# Altium schematic sheet 02 - POWER.SchDoc
size 420 x 297 mm
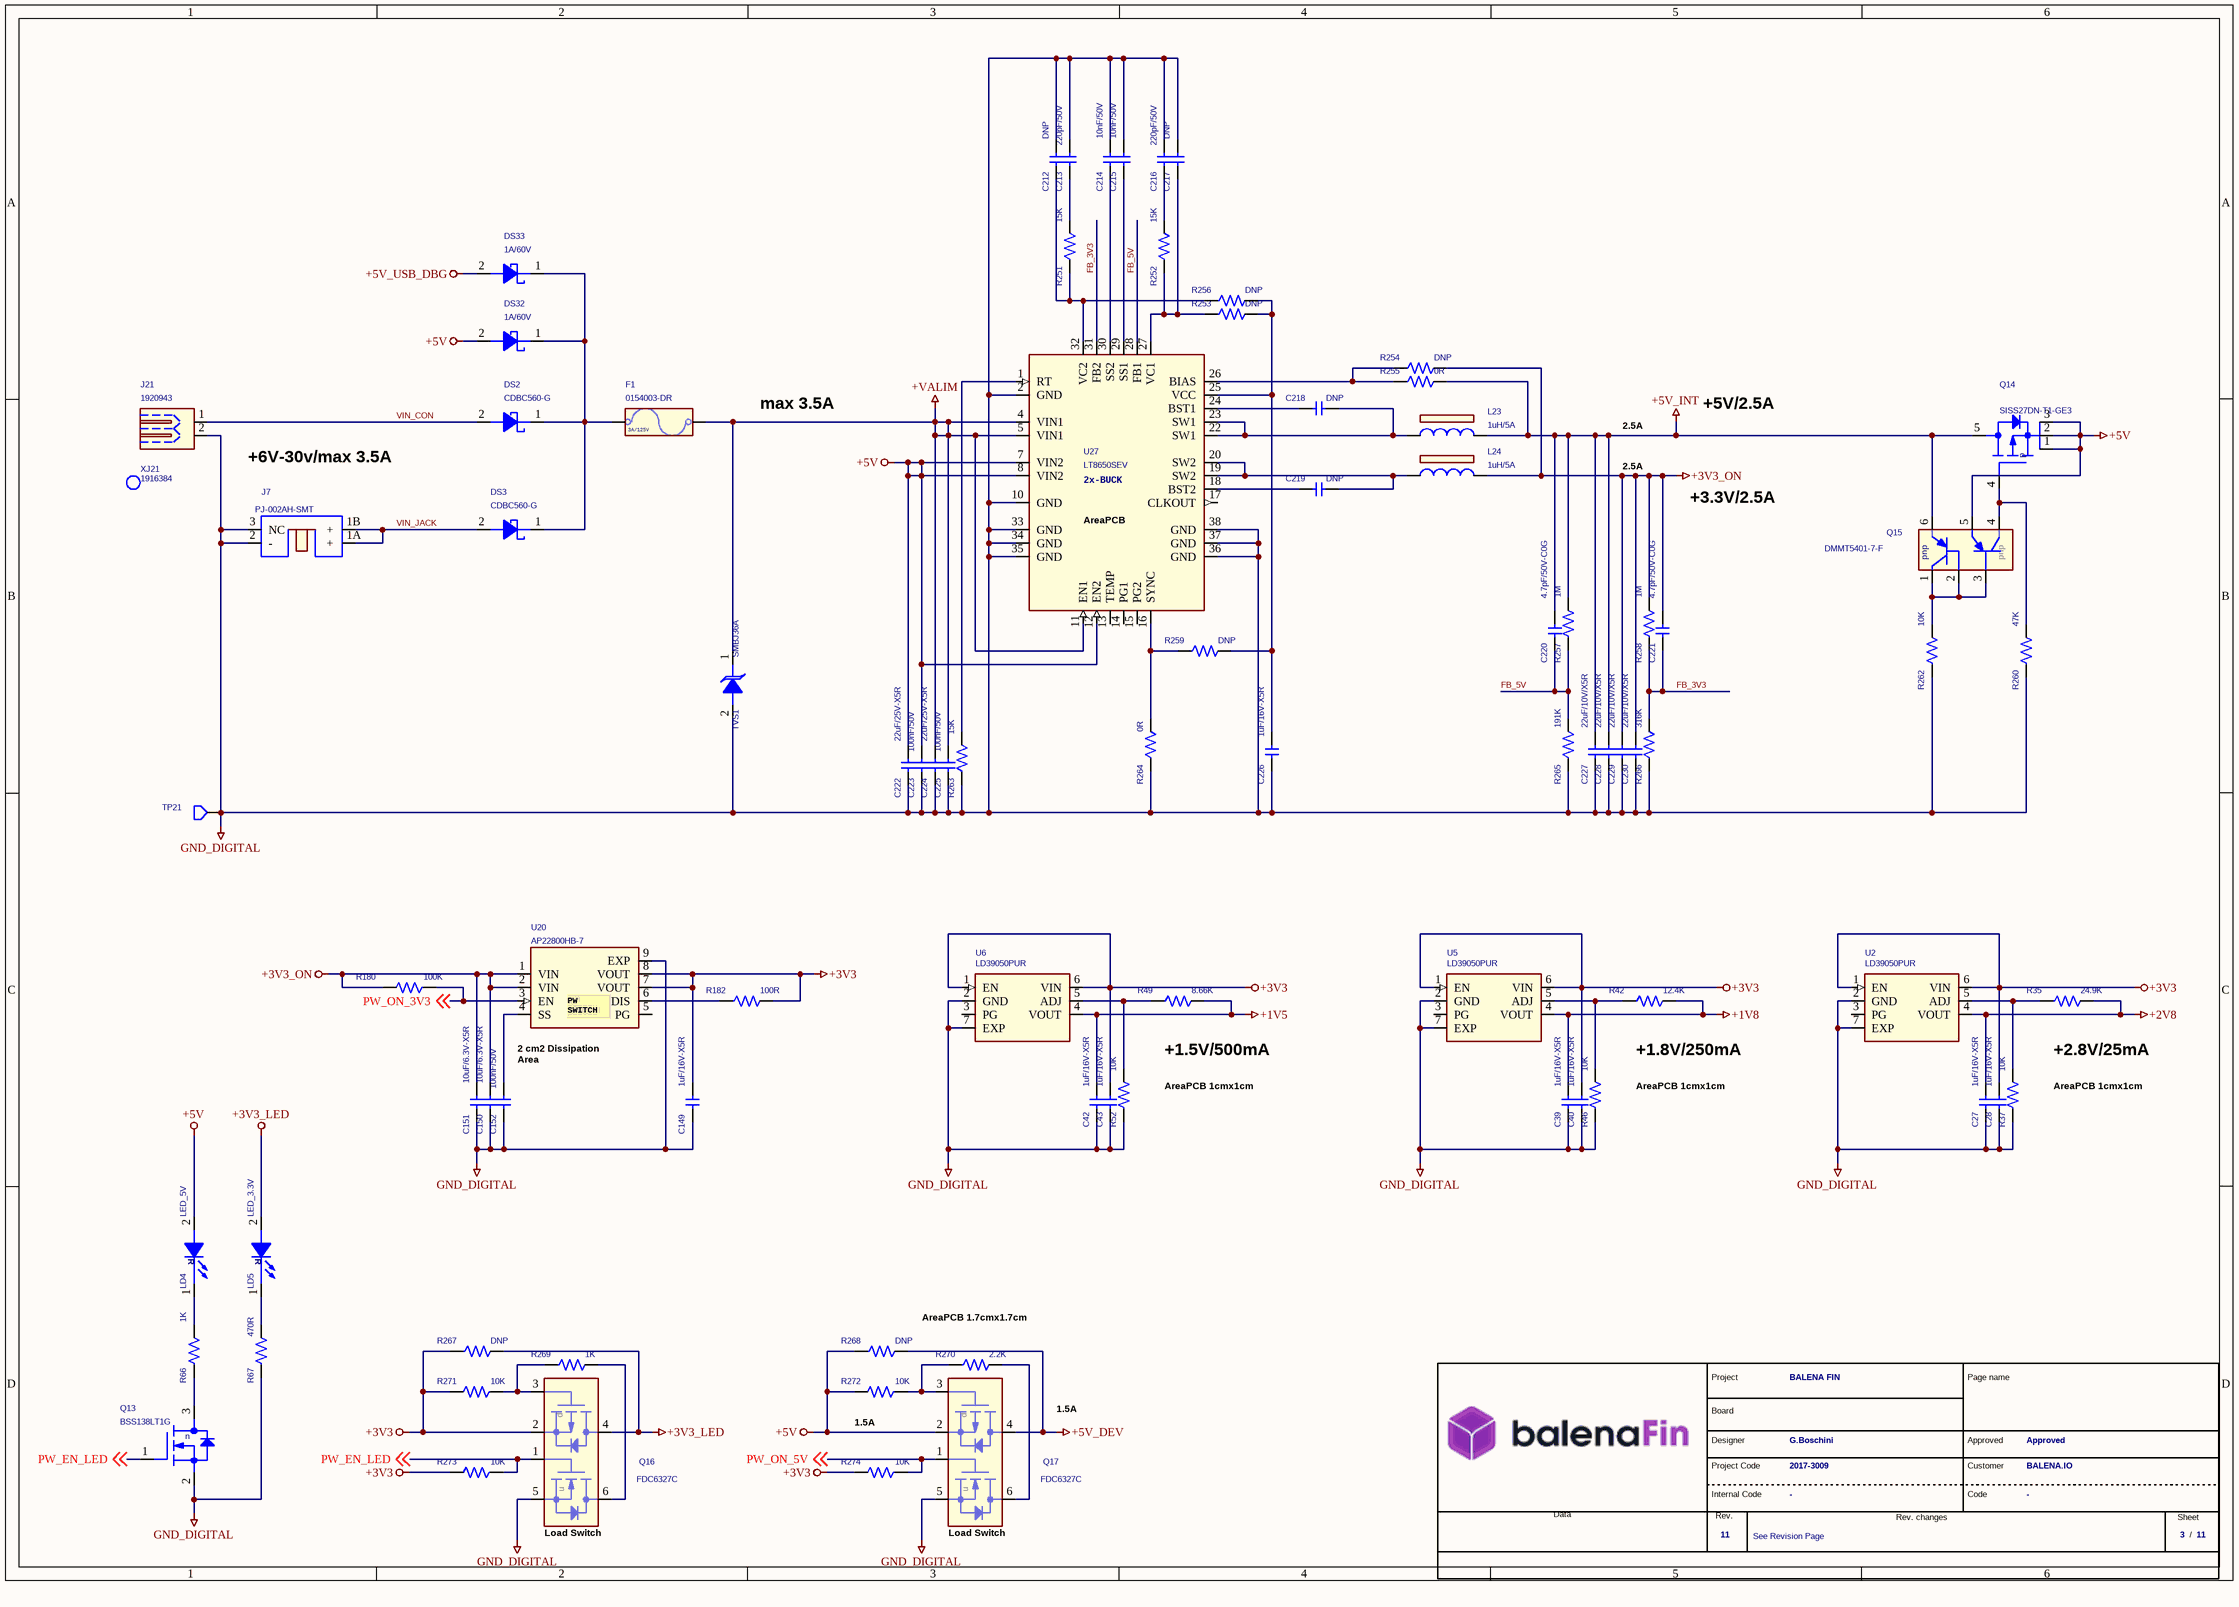
[diagram p0: 02 - POWER.SchDoc]

## Parts
*  Revision: 11  FAE RD code: 2017-3009  DocumentoRev: See Revision Page  Page Number: 3  Nome Progetto: BALENA FIN  Customer name: BALENA.IO  Project manager: Approved  Project designer: G.Boschini  (hidden comment: MyFAEVuoto)  (graphical)
C27  1uF/16V-X5R  [CS-C-0402]
C28  1uF/16V-X5R  [CS-C-0402]
C39  1uF/16V-X5R  [CS-C-0402]
C40  1uF/16V-X5R  [CS-C-0402]
C42  1uF/16V-X5R  [CS-C-0402]
C43  1uF/16V-X5R  [CS-C-0402]
C149  1uF/16V-X5R  [CS-C-0402]
C150  10uF/6.3V-X5R  [CS-C-0402]
C151  10uF/6.3V-X5R  [CS-C-0402]
C152  100nF/50V  [CS-C-0402]
C212  DNP  [CS-C-0402]
C213  220pF/50V  [CS-C-0402]
C214  10nF/50V  [CS-C-0402]
C215  10nF/50V  [CS-C-0402]
C216  220pF/50V  [CS-C-0402]
C217  DNP  [CS-C-0402]
C218  DNP  [CS-C-0402]
C219  DNP  [CS-C-0402]
C220  4.7pF/50V-C0G  [CS-C-0402]
C221  4.7pF/50V-C0G  [CS-C-0402]
C222  22uF/25V-X5R  [CS-C-1206]
C223  100nF/50V  [CS-C-0603]
C224  22uF/25V-X5R  [CS-C-1206]
C225  100nF/50V  [CS-C-0603]
C226  1uF/16V-X5R  [CS-C-0402]
C227  22uF/10V/X5R  [CS-C-0603]
C228  22uF/10V/X5R  [CS-C-0603]
C229  22uF/10V/X5R  [CS-C-0603]
C230  22uF/10V/X5R  [CS-C-0603]
DS2  CDBC560-G  [SMC]
DS3  CDBC560-G  [SMC]
DS32  1A/60V  [SMA]
DS33  1A/60V  [SMA]
F1  0154003-DR  [F-LT154]
J7  PJ-002AH-SMT  [J-CUPJ002AH]
J21  1920943  [J-2-0350-MOT-MC]
L23  1uH/5A  [LS-VIIHLP1212BZ11]
L24  1uH/5A  [LS-VIIHLP1212BZ11]
LD4  LED_5V  [LD-0603]
LD5  LED_3.3V  [LD-0603]
Q13  BSS138LT1G  [SOT23]
Q14  SISS27DN-T1-GE3  [POWERVDFN8-0330X0330]
Q15  DMMT5401-7-F  [SOT23-6L]
Q16  FDC6327C  [SOT23-6-DBV]
Q17  FDC6327C  [SOT23-6-DBV]
R35  24.9K  [RS-0402]
R37  10K  [RS-0402]
R42  12.4K  [RS-0402]
R46  10K  [RS-0402]
R49  8.66K  [RS-0402]
R52  10K  [RS-0402]
R66  1K  [RS-0402]
R67  470R  [RS-0402]
R180  100K  [RS-0402]
R182  100R  [RS-1206]
R251  15K  [RS-0402]
R252  15K  [RS-0402]
R253  DNP  [RS-0402]
R254  DNP  [RS-0402]
R255  0R  [RS-0402]
R256  DNP  [RS-0402]
R257  1M  [RS-0402]
R258  1M  [RS-0402]
R259  DNP  [RS-0402]
R260  47K  [RS-0402]
R262  10K  [RS-0402]
R263  15K  [RS-0402]
R264  0R  [RS-0402]
R265  191K  [RS-0402]
R266  316K  [RS-0402]
R267  DNP  [RS-0603]
R268  DNP  [RS-0603]
R269  1K  [RS-0402]
R270  2.2K  [RS-0402]
R271  10K  [RS-0402]
R272  10K  [RS-0402]
R273  10K  [RS-0402]
R274  10K  [RS-0402]
TP21  TPT  [TPT-0100]  (value not drawn)
TVS1  SMBJ36A  [SMB]
U2  LD39050PUR  [DFN6_3X3_STM-L]
U5  LD39050PUR  [DFN6_3X3_STM-L]
U6  LD39050PUR  [DFN6_3X3_STM-L]
U20  AP22800HB-7  [UFDFN8-EXP-0210X0160]
U27  LT8650SEV  [IC-LT8650SEV]
XJ21  1916384  (mechanical)

## Nets
+1V5: C42.1 R49.2 U6.4(VOUT)
+1V8: C39.1 R42.2 U5.4(VOUT)
+2V8: C27.1 R35.2 U2.4(VOUT)
+3V3: C28.1 C40.1 C43.1 C149.1 Q16.2(S1) R182.2 R267.1 R271.2 R273.2 R274.2 U2.1(EN) U2.6(VIN) U5.1(EN) U5.6(VIN) U6.1(EN) U6.6(VIN) U20.7(VOUT) U20.8(VOUT)
+3V3_LED: LD5.2(A) Q16.4(D1) R267.2
+3V3_ON: C150.1 C151.1 C221.1 C229.1 C230.1 L24.2 R180.2 R254.2 R258.2 U20.1(VIN) U20.2(VIN)
+5V: C222.1 C223.1 DS32.2(A) LD4.2(A) Q14.1(S_1) Q14.2(S_2) Q14.3(S_3) Q15.5(E2) Q17.2(S1) R268.1 R272.2 U27.7(VIN2) U27.8(VIN2) U27.12(EN2)
+5V_DEV: Q17.4(D1) R268.2
+5V_INT: C220.1 C227.1 C228.1 L23.2 Q14.5(D_5) Q15.6(E1) R255.2 R257.2
+5V_USB_DBG: DS33.2(A)
+VALIM: C224.1 C225.1 F1.2 TVS1.1(C) U27.4(VIN1) U27.5(VIN1) U27.11(EN1)
GND_DIGITAL: C27.2 C28.2 C39.2 C40.2 C42.2 C43.2 C149.2 C150.2 C151.2 C152.2 C212.1 C213.1 C214.1 C215.1 C216.1 C217.1 C222.2 C223.2 C224.2 C225.2 C226.2 C227.2 C228.2 C229.2 C230.2 J7.2(-) J7.3(NC) J21.2 Q13.2(S) Q16.5(S2) Q17.5(S2) R37.1 R46.1 R52.1 R67.1 R260.1 R262.1 R263.1 R264.1 R265.1 R266.1 TP21.1(TP) TVS1.2(A) U2.2(GND) U2.7(EXP) U5.2(GND) U5.7(EXP) U6.2(GND) U6.7(EXP) U20.9(EXP) U27.2(GND) U27.10(GND) U27.33(GND) U27.34(GND) U27.35(GND) U27.36(GND) U27.37(GND) U27.38(GND)
FB_3V3: C221.2 R258.1 R266.2 U27.31(FB2)
FB_5V: C220.2 R257.1 R265.2 U27.28(FB1)
PW_EN_LED: Q13.1(G) Q16.1(G2) R273.1 ; off-sheet PW_EN_LED
PW_ON_3V3: R180.1 U20.3(EN) ; off-sheet PW_ON_3V3
PW_ON_5V: Q17.1(G2) R274.1 ; off-sheet PW_ON_5V
VIN_CON: DS2.2(A) J21.1
VIN_JACK: DS3.2(A) J7.1A(+) J7.1B(+)
NetC152_1: C152.1 U20.4(SS)
NetC212_2: C212.2 R251.1 R256.1 U27.32(VC2)
NetC213_2: C213.2 R251.2
NetC214_2: C214.2 U27.30(SS2)
NetC215_2: C215.2 U27.29(SS1)
NetC216_2: C216.2 R252.2
NetC217_2: C217.2 R252.1 R253.1 U27.27(VC1)
NetC218_1: C218.1 U27.24(BST1)
NetC218_2: C218.2 L23.1 U27.22(SW1) U27.23(SW1)
NetC219_1: C219.1 U27.18(BST2)
NetC219_2: C219.2 L24.1 U27.19(SW2) U27.20(SW2)
NetC226_1: C226.1 R253.2 R256.2 R259.2 U27.25(VCC)
NetDS2_1: DS2.1(C) DS3.1(C) DS32.1(C) DS33.1(C) F1.1
NetLD4_1: LD4.1(C) R66.2
NetLD5_1: LD5.1(C) R67.2
NetQ13_3: Q13.3(D) R66.1
NetQ14_4: Q14.4(G) Q15.4(C2) R260.2
NetQ15_1: Q15.1(C1) Q15.2(B1) Q15.3(B2) R262.2
NetQ16_3: Q16.3(G1) R269.1 R271.1
NetQ16_6: Q16.6(D2) R269.2
NetQ17_3: Q17.3(G1) R270.1 R272.1
NetQ17_6: Q17.6(D2) R270.2
NetR35_1: R35.1 R37.2 U2.5(ADJ)
NetR42_1: R42.1 R46.2 U5.5(ADJ)
NetR49_1: R49.1 R52.2 U6.5(ADJ)
NetR182_1: R182.1 U20.6(DIS)
NetR254_1: R254.1 R255.1 U27.26(BIAS)
NetR259_1: R259.1 R264.2 U27.16(SYNC)
NetR263_2: R263.2 U27.1(RT)

Not connected (* = marked no-connect by the designer): U2 3(PG); U5 3(PG); U6 3(PG); U20 5(PG); U27 13(TEMP) 14(PG1) 15(PG2) 17(CLKOUT)

## Notes on the sheet
- +6V-30v/max 3.5A
- max 3.5A
- 2.5A
- +5V/2.5A
- (near U27) AreaPCB
- +3.3V/2.5A
- 2 cm2 Dissipation
  Area
- +1.5V/500mA
- +1.8V/250mA
- +2.8V/25mA
- AreaPCB 1cmx1cm
- AreaPCB 1.7cmx1.7cm
- 1.5A
- (near Q16) Load Switch
- (near Q17) Load Switch
- (in symbol BUCK-2X-LT8650SEV- 4A/ADJ) 2x-BUCK
- (in symbol LED R - GENERICO - 0603) R
- (in symbol MyFAEVuoto) Project; Page name; Board; Designer; Project Code; Customer; Internal Code; Code; Data; Rev.; Rev. changes; Sheet; /
- (in symbol N-P MOS-FDC6327C-2.7A/1.9A/20V) p; n
- (in symbol NMOS - BSS138 - 0.2A/50V) n
- (in symbol PMOS - SISS27DN - 23A/30V) p
- (in symbol PNPPNP - DMMT5401-7-F-0.2A/150V) pnp
- (in symbol PSW - 1x - AP22800HB-7) PW / SWITCH
- (in symbol RAPIDO - 0154003.DR - 3A/125V) 3A/125V

## Library data of the parts
C27 C28 = CS-C-0402-1u/16-X5R: CHIP CAP.CER. 1uF 16V 10% X5R 0402; MPN: Generic; Pkg Type: SMD; Room: POWER 2V8; Mount: Yes
C39 C40 = CS-C-0402-1u/16-X5R: CHIP CAP.CER. 1uF 16V 10% X5R 0402; MPN: Generic; Pkg Type: SMD; Room: POWER 1V8; Mount: Yes
C42 C43 = CS-C-0402-1u/16-X5R: CHIP CAP.CER. 1uF 16V 10% X5R 0402; MPN: Generic; Pkg Type: SMD; Room: POWER 1V5; Mount: Yes
C149 = CS-C-0402-1u/16-X5R: CHIP CAP.CER. 1uF 16V 10% X5R 0402; MPN: Generic; Pkg Type: SMD; Room: SWITCH-PW-3V3; Mount: Yes
C150 C151 = CS-C-0402-10u/6V3-X5R: CHIP CAP.CER. 10uF 6.3V 20% X5R 0402; MPN: Generic; Alternative MPN: CC0402MRX5R5BB106; Pkg Type: SMD; Room: SWITCH-PW-3V3; Temperature range: -55°..+85°; Mount: Yes
C152 = CS-C-0402-100n/16V: CHIP CAP.CER. 100nF 16V 10% X7R 0402; MPN: Generic; Alternative MPN: C0402C104K4RACTU; Room: SWITCH-PW-3V3; Pkg Type: SMD; Mount: Yes
C212 C217 = CS-C-0402: CHIP CAP.CER. 0402; MPN: Generic; Room: POWER 5V-3V3; Pkg Type: SMD; Mount: No
C213 C216 = CS-C-0402-220p/50V: CHIP CAP.CER. 220pF 50V 10% X7R 0402; MPN: Generic; Room: POWER 5V-3V3; Pkg Type: SMD; Mount: Yes
C214 C215 = CS-C-0402-10n/50V: CHIP CAP.CER. 10nF 50V 10% X7R 0402; MPN: Generic; Alternative MPN: C0402C103K5RACTU; Room: POWER 5V-3V3; Pkg Type: SMD; Mount: Yes
C218 C219 = CS-C-0402: CHIP CAP.CER. 0402; MPN: Generic; Pkg Type: SMD; Mount: No
C220 C221 = CS-C-0402-4.7p/50V-C0G: CHIP CAP.CER. 4.7pF 50V 5% C0G 0402; MPN: Generic; Pkg Type: SMD; Room: POWER 5V-3V3; Temperature range: -55°..+125°; Mount: Yes
C222 C224 = CS-C-1206-22u/25V-X5R: CHIP CAP.CER. 22uF 25V 10% X5R 1206; MPN: Generic; Room: POWER 5V-3V3; Pkg Type: SMD; Temperature range: -55°..+85°; Mount: Yes
C223 C225 = CS-C-0603-100n/50V: CHIP CAP.CER. 100nF 50V 10% X7R 0603; MPN: Generic; Alternative MPN: C0402C104K4RACTU; Room: POWER 5V-3V3; Pkg Type: SMD; Mount: Yes
C226 = CS-C-0402-1u/16-X5R: CHIP CAP.CER. 1uF 16V 10% X5R 0402; MPN: Generic; Pkg Type: SMD; Room: POWER 5V-3V3; Mount: Yes
C227-C230 = CS-C-0603-22u/10V/X5R: CHIP CAP.CER. 22uF 10V 20% X5R 0603; MPN: Generic; Pkg Type: SMD; Room: POWER 5V-3V3; Temperature range: -55°..+85°; Mount: Yes
DS2 DS3 = SCHOTTKY-CDBC560-G - 5A/60V: DIODE SCHOTTKY 5A 60V CDBC560-G DO214AB SMT; Pkg Type: SMD; Room: POWER IN; MPN: CDBC560-G; Mount: Yes
DS32 DS33 = SCHOTTKY-MBRA160 - 1A/60V: DIODE SCHOTTKY 1A 60V MBRA160T3G SMA SMT; Pkg Type: SMD; Room: POWER IN; MPN: MBRA160T3G; Mount: Yes
F1 = RAPIDO - 0154003.DR - 3A/125V: FUSE BOARD MNT 3A 125VAC/VDC SMD; Room: POWER IN; Pkg Type: SMD; MPN: 0154003-DR; Mount: Yes
J7 = JACK-PW - J-CUPJ002AH: CONN. POWER JACK F/90° PJ-002AH-SMT-TR CUI SMT; Alternative MPN: 694106106102; Pkg Type: SMD; Note: ID=2.1mm OD=5.5mm; Room: POWER IN; MPN: PJ-002AH-SMT; Mount: Yes
J21 = MC - J-2-0350-MOT-MC: TERM BLOCK HDR 2POS 90DEG 3.5MM; Pkg Type: THT; Room: POWER IN; MPN: 1920943; Mount: Yes
L23 L24 = PW-IHLP1212BZER1R0M11-1u/5A: FIXED IND 1UH 5A 24 MOHM SMD; Room: POWER 5V-3V3; Pkg Type: SMD; Temperature range: -55°..+125°; MPN: IHLP1212BZER1R0M11; Mount: Yes
LD4 LD5 = LED R - GENERICO - 0603: LED Red 0603 SMT; Alternative MPN: LTST-C191KRKT; Pkg Type: SMD; Note: 2V/20mA; Room: POWER LED; MPN: Generic; Mount: Yes
Q13 = NMOS - BSS138 - 0.2A/50V: MOSFET N-CH 50V 220MA SOT23-3; Room: HDMI; Pkg Type: SMD; MPN: BSS138LT1G; Mount: Yes
Q14 = PMOS - SISS27DN - 23A/30V: MOSFET P-CH 30V 50A PPAK 1212-8S; Pkg Type: SMD; Room: POWER 5V-3V3; Temperature range: -65°..+150°; MPN: SISS27DN-T1-GE3; Mount: Yes
Q15 = PNPPNP - DMMT5401-7-F-0.2A/150V: TRANS 2PNP 150V 0.2A SOT26; Room: POWER 5V-3V3; Pkg Type: SMD; Temperature range: -55°..+150°; MPN: DMMT5401-7-F; Mount: Yes
Q16 = N-P MOS-FDC6327C-2.7A/1.9A/20V: MOSFET N/P-CH 20V SSOT-6; Room: SWITCH-PW-LED; Pkg Type: SMD; Temperature range: -55°..+150°; MPN: FDC6327C; Mount: Yes
Q17 = N-P MOS-FDC6327C-2.7A/1.9A/20V: MOSFET N/P-CH 20V SSOT-6; Room: SWITCH-PW-5V; Pkg Type: SMD; Temperature range: -55°..+150°; MPN: FDC6327C; Mount: Yes
R35 = RS-0402-24.9k: CHIP RES. 24K9 0402 1/16W 1%; MPN: Generic; Room: POWER 2V8; Pkg Type: SMD; Mount: Yes
R37 = RS-0402-10k: CHIP RES. 10K 0402 1/16W 1%; MPN: Generic; Room: POWER 2V8; Pkg Type: SMD; Temperature range: -55°..+125°; Mount: Yes
R42 = RS-0402-12.4k: CHIP RES. 12K4 0402 1/16W 1% 100PPM/°C; MPN: Generic; Room: POWER 1V8; Note: 100ppm; Pkg Type: SMD; Mount: Yes
R46 = RS-0402-10k: CHIP RES. 10K 0402 1/16W 1%; MPN: Generic; Room: POWER 1V8; Pkg Type: SMD; Temperature range: -55°..+125°; Mount: Yes
R49 = RS-0402-8.66k: CHIP RES. 8K66 0402 1/16W 1% 100PPM/°C; MPN: Generic; Room: POWER 1V5; Note: 100ppm; Pkg Type: SMD; Temperature range: -55°..+155°; Mount: Yes
R52 = RS-0402-10k: CHIP RES. 10K 0402 1/16W 1%; MPN: Generic; Room: POWER 1V5; Pkg Type: SMD; Temperature range: -55°..+125°; Mount: Yes
R66 = RS-0402-1k: CHIP RES. 1K 0402 1/16W 1%; MPN: Generic; Pkg Type: SMD; Room: POWER LED; Mount: Yes
R67 = RS-0402-470r: CHIP RES. 470R 0402 1/16W 1%; MPN: Generic; Pkg Type: SMD; Room: POWER LED; Mount: Yes
R180 = RS-0402-100k: CHIP RES. 100K 0402 1/16W 1%; MPN: Generic; Pkg Type: SMD; Room: SWITCH-PW-3V3; Mount: Yes
R182 = RS-1206-100r: CHIP RES. 100R 1206 1/4W 1%; MPN: Generic; Pkg Type: SMD; Room: SWITCH-PW-3V3; Mount: Yes
R251 R252 R263 = RS-0402-15k: CHIP RES. 15K 0402 1/16W 1%; MPN: Generic; Pkg Type: SMD; Room: POWER 5V-3V3; Temperature range: -55°..+155°; Mount: Yes
R253 R254 R256 R259 = RS-0402: CHIP RES. 0402; MPN: Generic; Pkg Type: SMD; Room: POWER 5V-3V3; Mount: No
R255 R264 = RS-0402-0r: CHIP RES. 0R 0402 1/16W 1%; MPN: Generic; Room: POWER 5V-3V3; Pkg Type: SMD; Mount: Yes
R257 R258 = RS-0402-1M: CHIP RES. 1M 0402 1/16W 1%; MPN: Generic; Room: POWER 5V-3V3; Pkg Type: SMD; Mount: Yes
R260 = RS-0402-47k: CHIP RES. 47K 0402 1/16W 1% 100PPM/°C; MPN: Generic; Pkg Type: SMD; Note: 100ppm; Room: POWER 5V-3V3; Mount: Yes
R262 = RS-0402-10k: CHIP RES. 10K 0402 1/16W 1%; MPN: Generic; Room: POWER 5V-3V3; Pkg Type: SMD; Temperature range: -55°..+125°; Mount: Yes
R265 = RS-0402-191k: CHIP RES. 191K 0402 1/16W 1%; MPN: Generic; Pkg Type: SMD; Room: POWER 5V-3V3; Mount: Yes
R266 = RS-0402-316k: CHIP RES. 316K 0402 1/16W 1%; MPN: Generic; Room: POWER 5V-3V3; Pkg Type: SMD; Mount: Yes
R267 = RS-0603: CHIP RES. 0603; MPN: Generic; Pkg Type: SMD; Room: SWITCH-PW-LED; Mount: No
R268 = RS-0603: CHIP RES. 0603; MPN: Generic; Pkg Type: SMD; Room: SWITCH-PW-5V; Mount: No
R269 = RS-0402-1k: CHIP RES. 1K 0402 1/16W 1%; MPN: Generic; Pkg Type: SMD; Room: SWITCH-PW-LED; Mount: Yes
R270 = RS-0402-2.2k: CHIP RES. 2K2 0402 1/16W 1%; MPN: Generic; Room: SWITCH-PW-5V; Pkg Type: SMD; Mount: Yes
R271 R273 = RS-0402-10k: CHIP RES. 10K 0402 1/16W 1%; MPN: Generic; Room: SWITCH-PW-LED; Pkg Type: SMD; Temperature range: -55°..+125°; Mount: Yes
R272 R274 = RS-0402-10k: CHIP RES. 10K 0402 1/16W 1%; MPN: Generic; Room: SWITCH-PW-5V; Pkg Type: SMD; Temperature range: -55°..+125°; Mount: Yes
TP21 = TEST POINT THT - 2.2MM: PCB Test Point, Black, - Through Hole Mount, 1.02 mm, Phosphor Bronze, Tin Plated Contacts; MPN: 20-2137; Pkg Type: THT; Room: POWER IN; Mount: Yes
TVS1 = TVS-UNI - SMBJ36A - 36V/600W: TVS DIODE 36VWM 58.1VC SMB; Room: POWER IN; Pkg Type: SMD; Note: Unidirectional; MPN: SMBJ36A; Mount: Yes
U2 = LDO - LD39050PUR - 0.5A/ADJ: Linear Voltage Regulator IC Positive Adjustable 1 Output 500mA 6-DFN (3x3); Pkg Type: SMD; Room: POWER 2V8; Temperature range: -40°..+125°; MPN: LD39050PUR; Mount: Yes
U5 = LDO - LD39050PUR - 0.5A/ADJ: Linear Voltage Regulator IC Positive Adjustable 1 Output 500mA 6-DFN (3x3); Pkg Type: SMD; Room: POWER 1V8; Temperature range: -40°..+125°; MPN: LD39050PUR; Mount: Yes
U6 = LDO - LD39050PUR - 0.5A/ADJ: Linear Voltage Regulator IC Positive Adjustable 1 Output 500mA 6-DFN (3x3); Pkg Type: SMD; Room: POWER 1V5; Temperature range: -40°..+125°; MPN: LD39050PUR; Mount: Yes
U20 = PSW - 1x - AP22800HB-7: IC PWR SWITCH N-CHAN 1:1 8UDFN; Pkg Type: SMD; Note: 1.5 -5.5V - 16mOHM; Power requirements: xV: 21uA; Room: SWITCH-PW-3V3; Temperature range: -40°..+85°; MPN: AP22800HB-7; Mount: Yes
U27 = BUCK-2X-LT8650SEV- 4A/ADJ: IC REG BCK 3.3V/5V 4A DL 32LQFN; Pkg Type: SMD; Note: 300kHz - 3MHz - VIN=3V - 42V; Room: POWER 5V-3V3; Temperature range: -40°..+125°; MPN: LT8650SEV; Mount: Yes
XJ21 = MORS.ESTR. - MC-3.50-2P: 2 Position Terminal Block Plug, Female Sockets 0.138" (3.50mm) - 180° Free Hanging (In-Line); Pkg Type: THT; Room: POWER IN; MPN: 1916384; Mount: Yes
* = MyFAEVuoto: Page Count: 11; Customer Code: -; Database: -